# EAGLE design encoderkit (EAGLE 9.2.2)
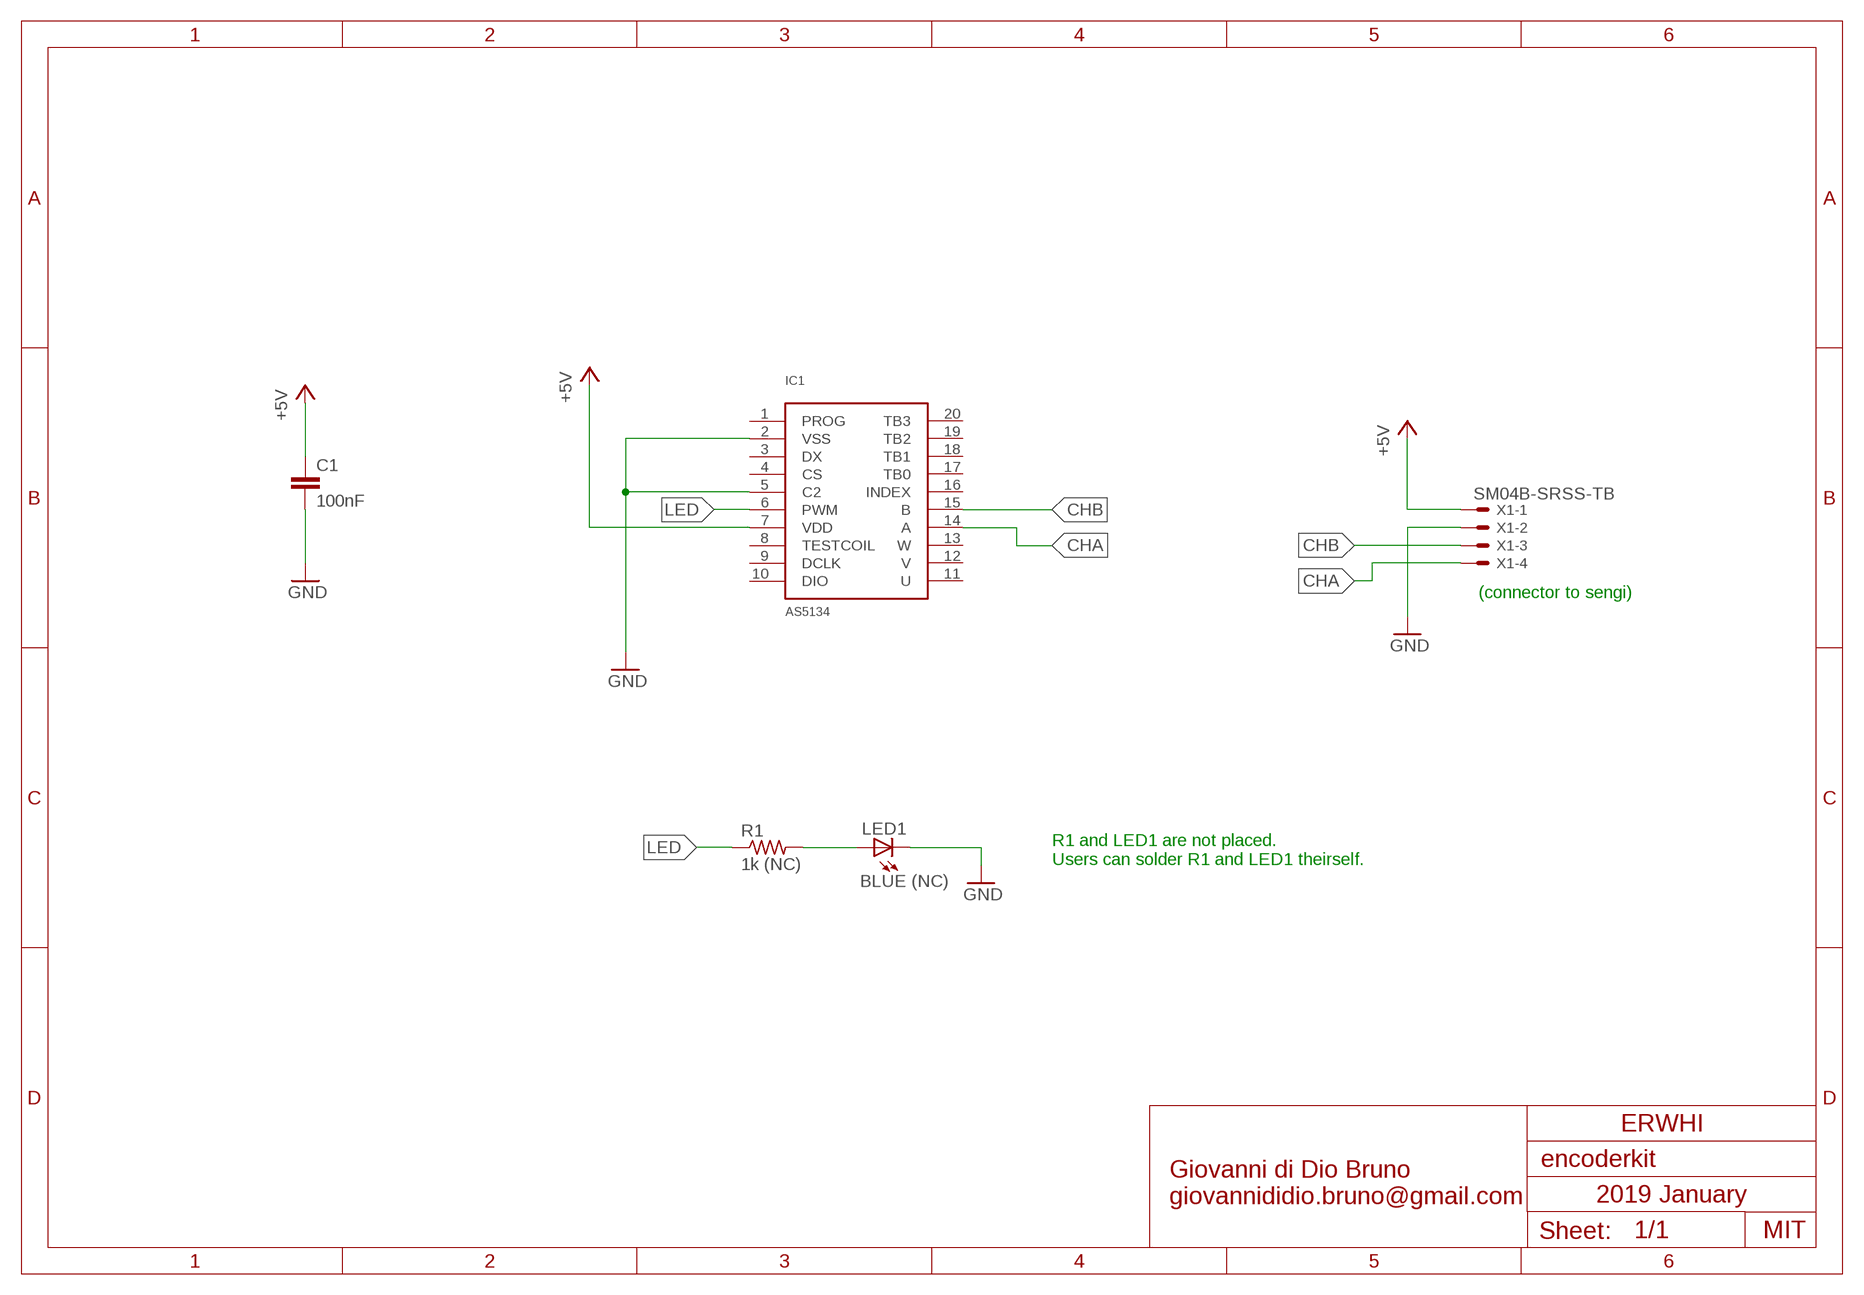
[diagram p0: schematic, sheet 1]

## Parts
C1  100nF  C-EUC0402  [C0402]
IC1  AS5134  [SSOP20]
LED1  BLUE (NC)  LEDCHIP-LED0603  [CHIP-LED0603]
R1  1k (NC)  R-US_R0402  [R0402]
X1  SM04B-SRSS-TB  [SM04B-SRSS-TB]

## Nets
+5V: C1.1 IC1.7(VDD) X1.1
CHA: IC1.14(A) X1.4
CHB: IC1.15(B) X1.3
GND: C1.2 IC1.2(VSS) IC1.5(C2) LED1.C X1.2
LED: IC1.6(PWM) R1.1
N$1: LED1.A R1.2
Unconnected: IC1.1(PROG) IC1.3(DX) IC1.4(CS) IC1.8(TESTCOIL) IC1.9(DCLK) IC1.10(DIO) IC1.11(U) IC1.12(V) IC1.13(W) IC1.16(INDEX) IC1.17(TB0) IC1.18(TB1) IC1.19(TB2) IC1.20(TB3)

## Notes on the sheet
- (connector to sengi)
- R1 and LED1 are not placed.
  Users can solder R1 and LED1 theirself.
- ERWHI
- 2019 January
- Giovanni di Dio Bruno
  giovannididio.bruno@gmail.com
- MIT

## Library data of the parts
C1 = resistor:C-EU: CAPACITOR, European symbol
IC1 = my01:AS5134
LED1 = led:LED: LED OSRAM: - CHIPLED LG R971, LG N971, LY N971, LG Q971, LY Q971, LO R971, LY R971 LH N974, LH R974 LS Q976, LO Q976, LY Q976 LO Q996 - Hyper CHIPLED LW Q18S LB Q993, LB Q99A, LB R99A - SideLED LS A670, LO A670, LY A670, LG A670, LP A670 LB A673, LV A673, LT A673, LW A673 LH A674 LY A675 LS A676, LA A676, LO A676, LY A676, LW A676 LS A679, LY A679, LG A679 - Hyper Micro SIDELED® LS Y876, LA Y876, LO Y876, LY Y876 LT Y87S - SmartLED LW L88C, LW L88S LB L89C, LB L89S, LG L890 LS L89K, LO L89K, LY L89K LS L896, LA L896, LO L896, LY L896 - TOPLED LS T670, LO T670, LY T670, LG T670, LP T670 LSG T670, LSP T670, LSY T670, LOP T670, LYG T670 LG T671, LOG T671, LSG T671 LB T673, LV T673, LT T673, LW T673 LH T674 LS T676, LA T676, LO T676, LY T676, LB T676, LH T676, LSB T676, LW T676 LB T67C, LV T67C, LT T67C, LS T67K, LO T67K, LY T67K, LW E67C LS E67B, LA E67B, LO E67B, LY E67B, LB E67C, LV E67C, LT E67C LW T67C LS T679, LY T679, LG T679 LS T770, LO T770, LY T770, LG T770, LP T770 LB T773, LV T773, LT T773, LW T773 LH T774 LS E675, LA E675, LY E675, LS T675 LS T776, LA T776, LO T776, LY T776, LB T776 LHGB T686 LT T68C, LB T68C - Hyper Mini TOPLED® LB M676 - Mini TOPLED Santana® LG M470 LS M47K, LO M47K, LY M47K Source: http://www.osram.convergy.de LUXEON: - LUMILED® LXK2-PW12-R00, LXK2-PW12-S00, LXK2-PW14-U00, LXK2-PW14-V00 LXK2-PM12-R00, LXK2-PM12-S00, LXK2-PM14-U00 LXK2-PE12-Q00, LXK2-PE12-R00, LXK2-PE12-S00, LXK2-PE14-T00, LXK2-PE14-U00 LXK2-PB12-K00, LXK2-PB12-L00, LXK2-PB12-M00, LXK2-PB14-N00, LXK2-PB14-P00, LXK2-PB14-Q00 LXK2-PR12-L00, LXK2-PR12-M00, LXK2-PR14-Q00, LXK2-PR14-R00 LXK2-PD12-Q00, LXK2-PD12-R00, LXK2-PD12-S00 LXK2-PH12-R00, LXK2-PH12-S00 LXK2-PL12-P00, LXK2-PL12-Q00, LXK2-PL12-R00 Source: www.luxeon.com KINGBRIGHT: KA-3528ASYC Source: www.kingbright.com
R1 = resistor:R-US_: RESISTOR, American symbol
X1 = con-jst2:?M04B-SRSS-TB: Disconnectable Crimp style connector, 1.0mm pitch 4 contacts

## Board
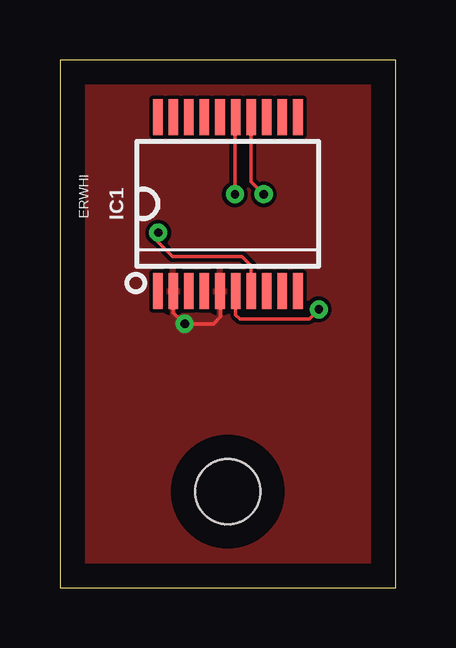
[diagram p1: board, top side]
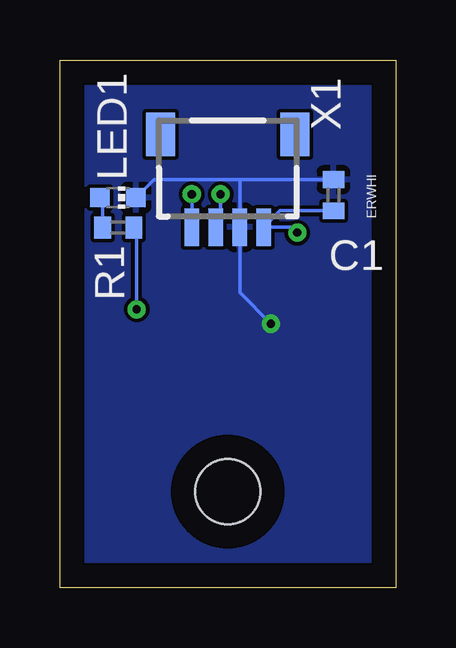
[diagram p2: board, bottom side, seen from below]

Size 14 x 22 mm. Coordinates in mm from the lower left corner, seen from the top.
Outline: 0,0 14,0 14,22 0,22 0,0
Copper layers (1*16): Top 0.035mm / dielectric 1.5mm / Bottom 0.035mm
Design rules "default": minimum track width 6mil, minimum drill 0.35mm, track to track 6mil, track to pad 6mil, pad to pad 6mil, via to via 6mil, smd to smd 6mil, copper to edge 40mil, drill to drill 6mil, minimum pad ring 10mil, minimum via ring 8mil, stop-mask expansion 4mil, vias tented up to drill 0mil, thermal gap 10mil
Holes 2.7 mm at 7,4

### Footprints (pad centres in the part's own frame; a part is rotated, then mirrored left to right if it is on the bottom)
C0402 = smd 0.7 x 0.9: 1 -0.65,0; 2 0.65,0
SSOP20 = smd 0.4 x 1.5: 1 -2.925,-3.625; 2 -2.275,-3.625; 3 -1.625,-3.625; 4 -0.975,-3.625; 5 -0.325,-3.625; 6 0.325,-3.625; 7 0.975,-3.625; 8 1.625,-3.625; 9 2.275,-3.625; 10 2.925,-3.625; 11 2.925,3.625; 12 2.275,3.625; 13 1.625,3.625; 14 0.975,3.625; 15 0.325,3.625; 16 -0.325,3.625; 17 -0.975,3.625; 18 -1.625,3.625; 19 -2.275,3.625; 20 -2.925,3.625
CHIP-LED0603 = smd 0.8 x 0.8: A 0,-0.75; C 0,0.75
R0402 = smd 0.7 x 0.9: 1 -0.65,0; 2 0.65,0
SM04B-SRSS-TB = smd 0.6 x 1.55: 1 -1.5,2.975; 2 -0.5,2.975; 3 0.5,2.975; 4 1.5,2.975 | smd 1.2 x 1.8: FIT@1 -2.8,-0.9; FIT@2 2.8,-0.9

### Placement (x,y rotation side)
C1  2.59,16.36 90 bottom
IC1  7,16 0 top
LED1  11.58,16.26 270 bottom
R1  11.57,15.01 180 bottom
X1  7,18 180 bottom

### Tracks (layer width: path | path; a pad name or v marks a point on that pad's centre or on a via)
+5V  (via drill 0.35)
  Top 0.152: IC1.7 7.97,13.43 7.6,13.8 4.7,13.8 4.1,14.4 v4.1,14.8
  Bottom 0.152: C1.1 4.82,15.71 X1.1 4.33,15.03 v4.1,14.8
CHA  (via drill 0.35)
  Top 0.152: v8.5,16.4 7.97,16.93 IC1.14
  Bottom 0.152: X1.4 v8.5,16.4
CHB  (via drill 0.35)
  Top 0.152: v7.3,16.4 7.3,19.6 IC1.15
  Bottom 0.152: X1.3 7.3,15.22 v7.3,16.4
GND  (via drill 0.35)
  Top 0.152: IC1.2 4.72,11.47 v5.2,11 6.4,11 6.7,11.3 6.7,12.35 IC1.5
  Bottom 0.152: C1.2 6.5,17.01 | 6.5,17.01 10.08,17.01 LED1.C | 6.5,17.01 X1.2 6.5,12.3 v5.2,11
  pour Top: -1.1,22.9 15.2,22.9 18.4,19.7 18.4,0.1 15.4,-2.9 -1.3,-2.9 -4,-0.2 -4,20
  pour Bottom: -5.3,21.1 -0.3,26.1 0.1,26.1 23.2,26.1 26.9,22.4 26.9,4.4 18.2,-4.3 -6.3,-4.3 -6.8,-3.8 -6.8,19.9 -5.3,21.4
LED  (via drill 0.35)
  Top 0.152: IC1.6 7.33,11.38 7.5,11.2 10.4,11.2 v10.8,11.6
  Bottom 0.152: v10.8,11.6 10.8,14.89 R1.1
N$1
  Bottom 0.152: LED1.A 12.22,16.15 R1.2

### Text on the board
tNames: ERWHI
bNames: ERWHI